# EAGLE design ForceBoard (EAGLE 9.4.2)
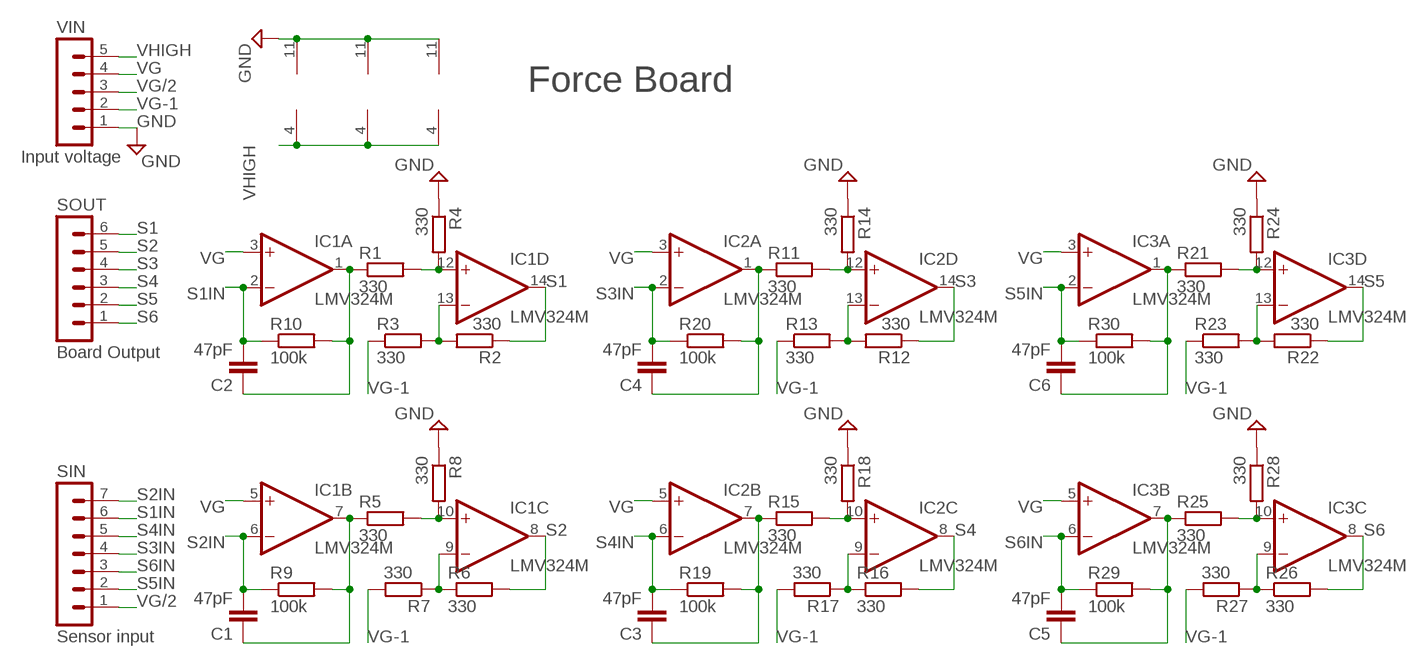
[diagram p0: schematic, sheet 1]

## Parts
C1  47pF  C-EUC0805  [C0805]
C2  47pF  C-EUC0805  [C0805]
C3  47pF  C-EUC0805  [C0805]
C4  47pF  C-EUC0805  [C0805]
C5  47pF  C-EUC0805  [C0805]
C6  47pF  C-EUC0805  [C0805]
IC1  LMV324M  [SO14]
IC2  LMV324M  [SO14]
IC3  LMV324M  [SO14]
R1  330  R-EU_R0805  [R0805]
R2  330  R-EU_R0805  [R0805]
R3  330  R-EU_R0805  [R0805]
R4  330  R-EU_R0805  [R0805]
R5  330  R-EU_R0805  [R0805]
R6  330  R-EU_R0805  [R0805]
R7  330  R-EU_R0805  [R0805]
R8  330  R-EU_R0805  [R0805]
R9  100k  R-EU_R0805  [R0805]
R10  100k  R-EU_R0805  [R0805]
R11  330  R-EU_R0805  [R0805]
R12  330  R-EU_R0805  [R0805]
R13  330  R-EU_R0805  [R0805]
R14  330  R-EU_R0805  [R0805]
R15  330  R-EU_R0805  [R0805]
R16  330  R-EU_R0805  [R0805]
R17  330  R-EU_R0805  [R0805]
R18  330  R-EU_R0805  [R0805]
R19  100k  R-EU_R0805  [R0805]
R20  100k  R-EU_R0805  [R0805]
R21  330  R-EU_R0805  [R0805]
R22  330  R-EU_R0805  [R0805]
R23  330  R-EU_R0805  [R0805]
R24  330  R-EU_R0805  [R0805]
R25  330  R-EU_R0805  [R0805]
R26  330  R-EU_R0805  [R0805]
R27  330  R-EU_R0805  [R0805]
R28  330  R-EU_R0805  [R0805]
R29  100k  R-EU_R0805  [R0805]
R30  100k  R-EU_R0805  [R0805]
SIN  Sensor input  MA07-1  [MA07-1]
SOUT  Board Output  MA06-1  [MA06-1]
VIN  Input voltage  MA05-1  [MA05-1]

## Nets
GND: IC1.11(P:V-) IC2.11(P:V-) IC3.11(P:V-) R4.1 R8.1 R14.1 R18.1 R24.1 R28.1 VIN.1
N$1: IC2.13(D:-IN) R12.2 R13.2
N$2: IC1.10(C:+IN) R5.2 R8.2
N$3: IC1.13(D:-IN) R2.2 R3.2
N$4: C1.1 IC1.7(B:OUT) R5.1 R9.2
N$5: IC1.9(C:-IN) R6.1 R7.1
N$6: IC1.12(D:+IN) R1.2 R4.2
N$7: C3.1 IC2.7(B:OUT) R15.1 R19.2
N$8: IC2.9(C:-IN) R16.1 R17.1
N$9: C2.1 IC1.1(A:OUT) R1.1 R10.2
N$10: IC2.10(C:+IN) R15.2 R18.2
N$11: IC2.12(D:+IN) R11.2 R14.2
N$12: C4.1 IC2.1(A:OUT) R11.1 R20.2
N$13: IC3.13(D:-IN) R22.2 R23.2
N$14: C5.1 IC3.7(B:OUT) R25.1 R29.2
N$15: IC3.9(C:-IN) R26.1 R27.1
N$16: IC3.10(C:+IN) R25.2 R28.2
N$17: IC3.12(D:+IN) R21.2 R24.2
N$18: C6.1 IC3.1(A:OUT) R21.1 R30.2
S1: IC1.14(D:OUT) R2.1 SOUT.6
S1IN: C2.2 IC1.2(A:-IN) R10.1 SIN.6
S2: IC1.8(C:OUT) R6.2 SOUT.5
S2IN: C1.2 IC1.6(B:-IN) R9.1 SIN.7
S3: IC2.14(D:OUT) R12.1 SOUT.4
S3IN: C4.2 IC2.2(A:-IN) R20.1 SIN.4
S4: IC2.8(C:OUT) R16.2 SOUT.3
S4IN: C3.2 IC2.6(B:-IN) R19.1 SIN.5
S5: IC3.14(D:OUT) R22.1 SOUT.2
S5IN: C6.2 IC3.2(A:-IN) R30.1 SIN.2
S6: IC3.8(C:OUT) R26.2 SOUT.1
S6IN: C5.2 IC3.6(B:-IN) R29.1 SIN.3
VG: IC1.3(A:+IN) IC1.5(B:+IN) IC2.3(A:+IN) IC2.5(B:+IN) IC3.3(A:+IN) IC3.5(B:+IN) VIN.4
VG-1: R3.1 R7.2 R13.1 R17.2 R23.1 R27.2 VIN.2
VG/2: SIN.1 VIN.3
VHIGH: IC1.4(P:V+) IC2.4(P:V+) IC3.4(P:V+) VIN.5

## Notes on the sheet
- Force Board

## Library data of the parts
C1-C6 = rcl:C-EU: CAPACITOR, European symbol; SPICEPREFIX: C
IC1-IC3 = linear:LMV324?*: Quad General Purpose, Low Voltage, Rail-to-Rail Output Operational Amplifiers Source: http://www.national.com/mpf/LM/LMV321.html http://www.national.com/dt/lmv_qual.pdf
R1-R30 = rcl:R-EU_: RESISTOR, European symbol; SPICEPREFIX: R
SIN = con-lstb:MA07-1: PIN HEADER; OC_FARNELL: unknown; OC_NEWARK: unknown
SOUT = con-lstb:MA06-1: PIN HEADER; OC_FARNELL: unknown; OC_NEWARK: unknown
VIN = con-lstb:MA05-1: PIN HEADER; OC_FARNELL: unknown; OC_NEWARK: unknown

## Board
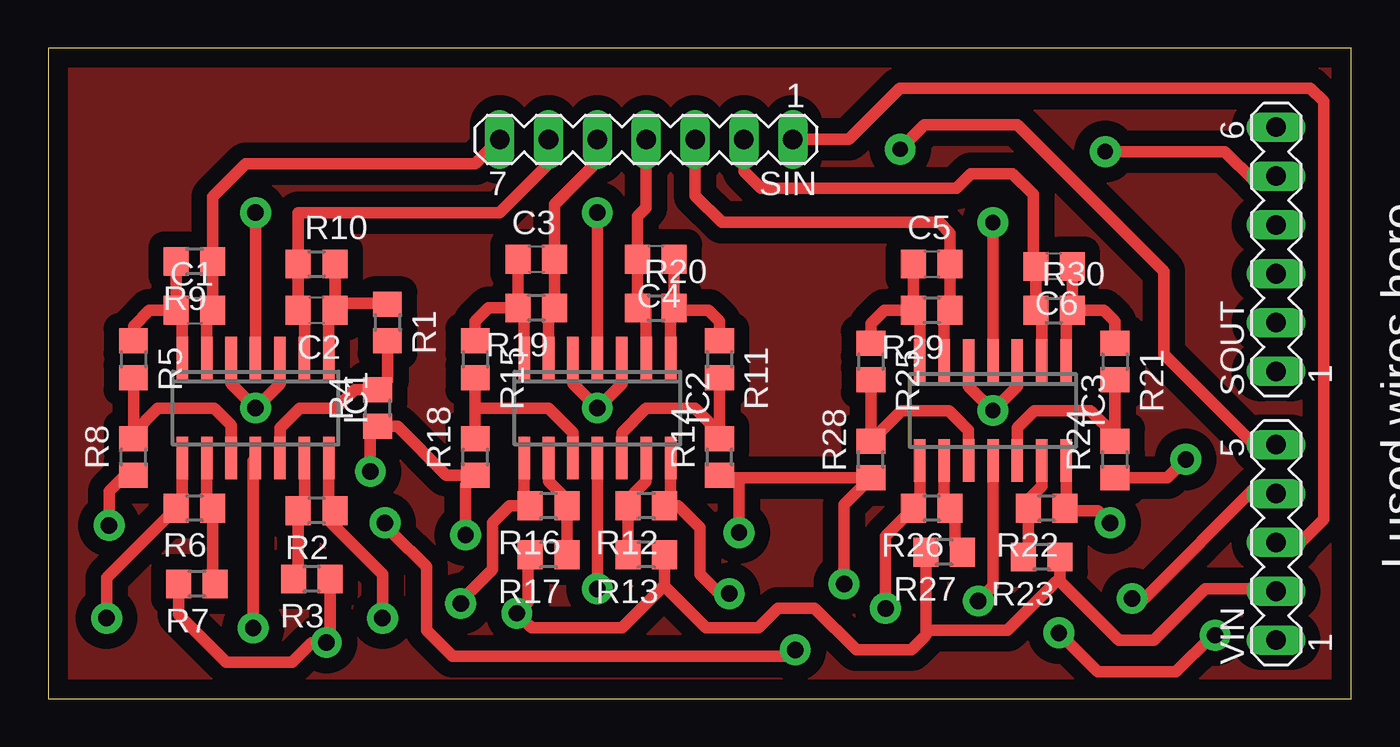
[diagram p1: board, top side]
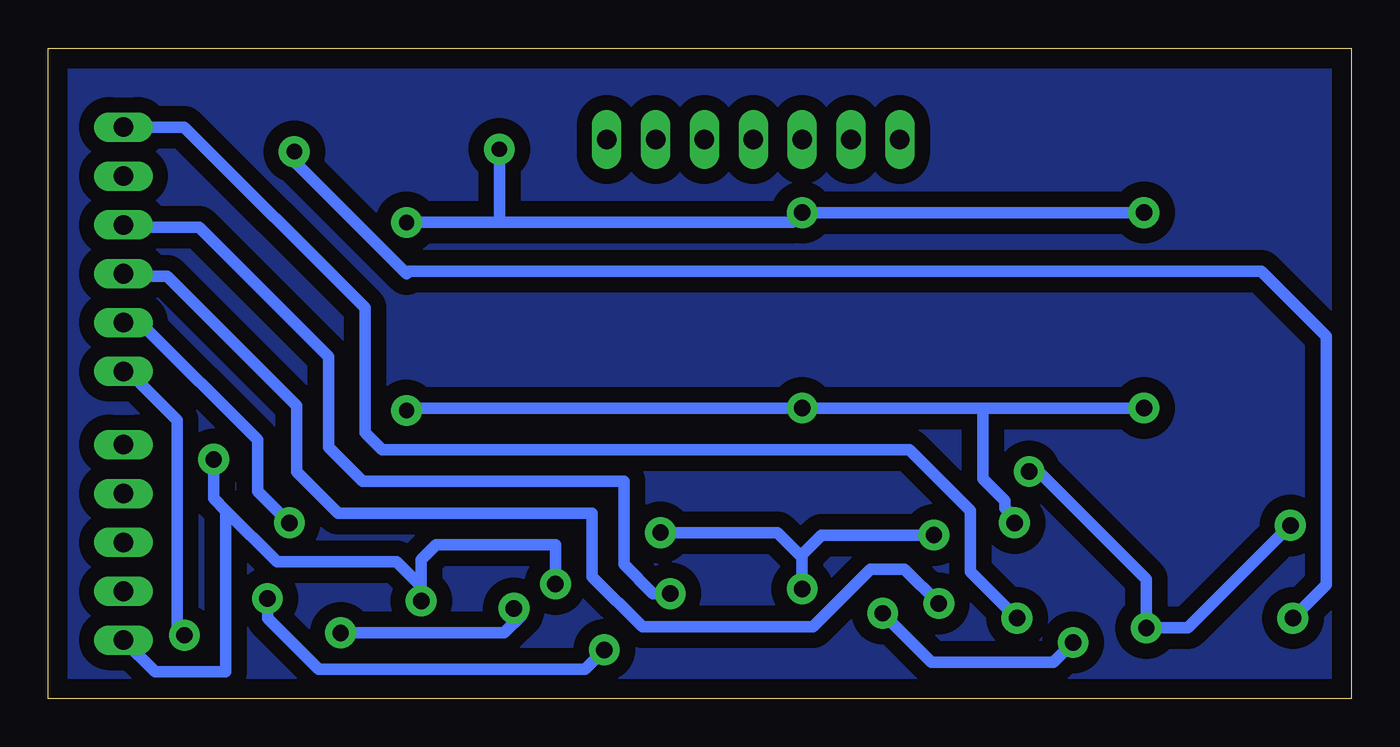
[diagram p2: board, bottom side, seen from below]

Size 67.8 x 33.83 mm. Coordinates in mm from the lower left corner, seen from the top.
Outline: 0,0 67.8,0 67.8,33.83 0,33.83 0,0
Copper layers (1*16): Top 0.035mm / dielectric 1.5mm / Bottom 0.035mm
Design rules "default": minimum track width 6mil, minimum drill 0.35mm, track to track 6mil, track to pad 6mil, pad to pad 6mil, via to via 6mil, smd to smd 6mil, copper to edge 40mil, drill to drill 6mil, minimum pad ring 10mil, minimum via ring 8mil, stop-mask expansion 4mil, vias tented up to drill 0mil, thermal gap 10mil

### Footprints (pad centres in the part's own frame; a part is rotated, then mirrored left to right if it is on the bottom)
C0805 = smd 1.3 x 1.5: 1 -0.95,0; 2 0.95,0
SO14 = smd 0.6 x 2.2: 1 -3.81,-2.6; 2 -2.54,-2.6; 3 -1.27,-2.6; 4 0,-2.6; 5 1.27,-2.6; 6 2.54,-2.6; 7 3.81,-2.6; 8 3.81,2.6; 9 2.54,2.6; 10 1.27,2.6; 11 0,2.6; 12 -1.27,2.6; 13 -2.54,2.6; 14 -3.81,2.6
R0805 = smd 1.3 x 1.5: 1 -0.95,0; 2 0.95,0
MA07-1 = drill 1.016 long: 1 -7.62,0; 2 -5.08,0; 3 -2.54,0; 4 0,0; 5 2.54,0; 6 5.08,0; 7 7.62,0
MA06-1 = drill 1.016 long: 1 -6.35,0; 2 -3.81,0; 3 -1.27,0; 4 1.27,0; 5 3.81,0; 6 6.35,0
MA05-1 = drill 1.016 long: 1 -5.08,0; 2 -2.54,0; 3 0,0; 4 2.54,0; 5 5.08,0

### Placement (x,y rotation side)
C1  7.62,20.19 0 top
C2  13.97,20.19 180 top
C3  25.4,22.86 0 top
C4  31.62,22.86 180 top
C5  45.97,22.61 0 top
C6  52.32,22.48 180 top
IC1  10.8,15.11 180 top
IC2  28.57,15.11 180 top
IC3  49.15,14.99 180 top
R1  17.65,19.56 270 top
R2  13.97,9.78 180 top
R3  13.72,6.22 180 top
R4  17.14,15.11 90 top
R5  4.45,17.65 270 top
R6  7.62,9.91 180 top
R7  7.75,5.97 180 top
R8  4.45,12.57 90 top
R9  7.62,22.73 180 top
R10  13.97,22.61 0 top
R11  34.92,17.65 270 top
R12  31.11,10.03 180 top
R13  31.11,7.49 180 top
R14  34.92,12.57 90 top
R15  22.23,17.65 270 top
R16  26.04,10.03 180 top
R17  26.04,7.49 180 top
R18  22.23,12.57 90 top
R19  25.4,20.32 180 top
R20  31.62,20.32 0 top
R21  55.5,17.53 270 top
R22  51.94,9.91 180 top
R23  51.69,7.37 180 top
R24  55.5,12.45 90 top
R25  42.8,17.53 270 top
R26  45.97,9.91 180 top
R27  46.61,7.62 180 top
R28  42.8,12.45 90 top
R29  45.97,20.19 180 top
R30  52.32,20.19 0 top
SIN  31.11,29.08 180 top
SOUT  63.88,23.37 90 top
VIN  63.88,8.13 90 top

### Tracks (layer width: path | path; a pad name or v marks a point on that pad's centre or on a via)
BOT
  pour Bottom (isolate 0.8): 67.44,0.13 67.44,33.15 0.38,33.15 0.38,0.13
GND  (via drill 0.85 pad 1.6)
  Top 0.61: IC1.11 10.67,12.39 v10.67,3.68 | v16.76,11.81 16.76,13.78 R4.1 18.17,14.16 20.71,11.62 R18.1 21.72,11.12 v21.72,8.51 | R8.1 4,11.62 3.18,10.79 v3.18,9.02 | IC2.11 v28.57,5.71 | R14.1 35.05,11.5 35.94,11.5 | 35.94,11.5 v35.94,8.64 | v41.4,5.97 41.4,10.1 R28.1 35.94,11.5 | IC3.11 49.15,5.84 v48.39,5.08 | v59.18,12.45 58.23,11.5 R24.1
  Bottom 0.61: v16.76,11.81 16.64,11.68 16.13,11.68 10.67,6.22 v10.67,3.68 8.51,3.68 v3.18,9.02 | v35.94,8.64 29.85,8.64 28.57,7.37 v28.57,5.71 28.57,7.49 27.56,8.51 v21.72,8.51 | v41.4,5.97 41.4,8 47.62,8 48.39,7.24 v48.39,5.08 48.39,5.84 49.66,7.11 55.88,7.11 58.55,9.78 | VIN.1 62.23,1.4 58.55,1.4 58.55,9.78 | v59.18,12.45 59.18,10.41 58.55,9.78
N$1
  Top 0.61: R13.2 R12.2 29.85,10.03 31.11,11.3 IC2.13
N$2
  Top 0.61: R5.2 R8.2 4.45,13.84 5.71,15.11 8.64,15.11 9.53,14.22 IC1.10
N$3
  Top 0.61: R3.2 13.02,6.48 R2.2 13.34,10.09 IC1.13
N$4
  Top 0.61: C1.1 6.98,19.88 IC1.7 | R9.2 C1.1 | R5.1 4.45,19.36 5.27,20.19 C1.1
N$5
  Top 0.61: IC1.9 8.26,10.22 R6.1 8.57,6.1 R7.1
N$6
  Top 0.61: R1.2 17.65,16.57 R4.2 15.94,16.06 14.99,15.11 13.08,15.11 12.07,14.1 IC1.12
N$7
  Top 0.61: IC2.7 24.77,20 R19.2 | C3.1 R19.2 | R15.1 22.23,19.62 22.93,20.32 R19.2
N$8
  Top 0.61: IC2.9 26.04,11.3 26.99,10.35 R16.1 R17.1
N$9
  Top 0.61: R1.1 17.59,20.57 14.61,20.57 14.61,20.19 | 14.61,20.19 C2.1 R10.2 | IC1.1 14.61,20.19
N$10
  Top 0.61: R15.2 22.23,15.11 | 22.23,15.11 R18.2 | 22.23,15.11 26.04,15.11 27.31,13.84 IC2.10
N$11
  Top 0.61: R11.2 34.92,13.84 | 34.92,13.84 R14.2 | IC2.12 29.85,13.84 31.11,15.11 33.66,15.11 34.92,13.84
N$12
  Top 0.61: R11.1 34.92,19.62 34.35,20.19 32.39,20.19 | IC2.1 32.39,20.19 | 32.39,20.19 32.39,20.32 R20.2 C4.1
N$13
  Top 0.61: IC3.13 51.69,11.05 50.99,10.35 R22.2 50.99,7.62 R23.2
N$14
  Top 0.61: C5.1 R29.2 | IC3.7 45.34,19.88 R29.2 | R29.2 43.5,20.19 42.8,19.49 R25.1
N$15
  Top 0.61: R27.1 47.18,8 47.18,9.65 R26.1 46.61,9.91 IC3.9
N$16
  Top 0.61: R25.2 R28.2 44.39,14.99 46.86,14.99 47.88,13.97 IC3.10
N$17
  Top 0.61: IC3.12 50.42,14.1 51.31,14.99 54.23,14.99 55.5,13.72 R24.2 R21.2
N$18
  Top 0.61: C6.1 R30.2 | R21.1 55.5,19.62 54.92,20.19 R30.2 | R30.2 52.96,19.88 IC3.1
S1  (via drill 0.85 pad 1.6)
  Top 0.61: R2.1 14.61,9.46 | v17.4,4.19 17.4,6.48 14.61,9.27 14.61,9.46 | IC1.14 14.61,9.53 14.61,9.46
  Bottom 0.61: v17.4,4.19 19.81,6.6 19.81,9.78 22.99,12.95 50.42,12.95 51.31,13.84 51.31,20.32 60.71,29.72 SOUT.6
S1IN
  Top 0.61: SIN.6 26.04,27.81 23.5,25.27 13.02,25.27 R10.1 C2.2 13.02,20 13.34,19.68 IC1.2
S2  (via drill 0.8 pad 1.6, 0.85 pad 1.6)
  Top 0.61: v54.99,28.45 61.21,28.45 62.74,26.92 63.63,26.92 SOUT.5 | v3.05,4.19 3.05,6.28 R6.2 6.98,10.22 IC1.8
  Bottom 0.61: v54.99,28.45 54.99,27.94 49.15,22.1 49.02,22.22 4.7,22.22 1.32,18.85 1.32,5.92 v3.05,4.19
S2IN
  Top 0.61: SIN.7 22.23,27.81 10.29,27.81 8.57,26.1 R9.1 C1.2 8.26,20.19 IC1.6
S3  (via drill 0.85 pad 1.6)
  Top 0.61: IC2.14 32.39,10.35 R12.1 32.77,10.03 33.91,8.89 33.91,6.48 34.92,5.46 v35.43,5.46
  Bottom 0.61: v35.43,5.46 36.32,5.46 37.85,6.99 37.85,11.3 51.44,11.3 53.21,13.08 53.21,17.78 59.94,24.51 63.75,24.51 SOUT.4
S3IN
  Top 0.61: SIN.4 31.11,25.53 30.67,25.08 C4.2 R20.1 30.74,20.25 31.05,20.25 31.11,20.19 IC2.2
S4  (via drill 0.85 pad 1.6)
  Top 0.61: IC2.8 24.77,10.35 R16.2 24,10.03 23.11,9.14 23.11,6.73 21.46,5.08 v21.46,4.95
  Bottom 0.61: v21.46,4.95 23.24,6.73 25.02,6.73 28.02,3.73 36.88,3.73 39.5,6.35 39.5,9.65 52.7,9.65 54.86,11.81 54.86,15.24 61.59,21.97 63.75,21.97 SOUT.3
S4IN
  Top 0.61: IC2.6 26.04,20.32 R19.1 C3.2 26.35,25.71 28.57,27.94 SIN.5
S5  (via drill 0.85 pad 1.6)
  Top 0.61: R22.1 52.93,9.94 | v55.25,9.14 54.61,9.78 53.09,9.78 52.93,9.94 | 52.93,9.94 52.8,10.07 52.96,10.23 IC3.14
  Bottom 0.61: SOUT.2 63.75,19.43 62.86,19.43 56.9,13.46 56.9,10.79 v55.25,9.14
S5IN
  Top 0.61: SIN.2 36.19,27.43 37.08,26.54 47.24,26.54 48.01,27.3 50.17,27.3 51.25,26.22 51.25,22.61 C6.2 R30.1 51.69,20.19 IC3.2
S6  (via drill 0.85 pad 1.6)
  Top 0.61: R26.2 | v43.56,4.7 43.56,8.45 R26.2 | R26.2 45.34,10.23 IC3.8 | v60.71,3.3 60.58,3.3 58.67,1.4 54.61,1.4 v52.58,3.43
  Bottom 0.61: SOUT.1 63.63,17.02 61.09,14.48 61.09,3.68 v60.71,3.3 | v52.58,3.43 44.07,3.43 43.18,4.32 43.18,4.7 v43.56,4.7
S6IN
  Top 0.61: SIN.3 33.66,26.16 35.05,24.77 46.36,24.77 46.92,24.2 C5.2 R29.1 46.61,19.88 IC3.6
TOP
  pour Top (isolate 0.8): 0.38,33.15 0.38,0.13 67.44,0.13 67.44,33.66 0.38,33.66
VG  (via drill 0.8 pad 1.6, 0.85 pad 1.6)
  Top 0.61: IC1.5 9.53,16.38 v10.8,15.11 12.07,16.38 IC1.3 | IC2.5 27.31,16.38 v28.57,15.11 29.85,16.38 IC2.3 | IC3.5 47.88,16.26 v49.15,14.99 50.42,16.26 IC3.3 | v17.53,9.14 17.91,8.76 17.91,8.64 19.68,6.86 19.68,3.56 21.03,2.21 38.53,2.21 v38.86,2.54 | v56.39,5.21 57.02,5.21 62.88,11.06 63.49,11.06 VIN.4
  Bottom 0.61: 19.18,15.11 v28.57,15.11 49.02,15.11 v49.15,14.99 | v10.8,15.11 19.18,15.11 | 19.18,15.11 19.18,11.43 18.03,10.29 18.03,9.91 17.53,9.4 v17.53,9.14 | v56.39,5.21 56.39,4.19 53.72,1.52 39.88,1.52 v38.86,2.54
VG-1  (via drill 0.85 pad 1.6)
  Top 0.61: R3.1 14.67,3.11 v14.48,2.92 13.72,2.92 12.7,1.9 9.27,1.9 6.8,4.38 R7.2 | R17.2 24.96,7.37 24.96,5.02 v24.38,4.45 25.15,3.68 29.85,3.68 32.06,5.9 R13.1 32.06,5.84 34.22,3.68 36.96,3.68 37.97,4.7 39.88,4.7 42.04,2.54 44.9,2.54 45.66,3.3 45.66,3.62 | 45.66,3.62 45.72,3.56 49.91,3.56 52.45,6.1 52.64,6.1 | R23.1 52.64,6.1 | 52.64,6.1 55.69,3.05 57.53,3.05 60.2,5.71 63.75,5.71 VIN.2 | 45.66,3.62 R27.2
  Bottom 0.61: v24.38,4.45 21.84,1.9 15.49,1.9 v14.48,2.92
VG/2
  Top 0.61: VIN.3 65.15,8.13 66.35,9.33 66.35,31.06 65.66,31.75 44.32,31.75 41.66,29.08 SIN.1
VHIGH  (via drill 0.8 pad 1.6, 0.85 pad 1.6)
  Top 0.61: IC1.4 v10.8,25.27 | IC2.4 v28.57,25.27 | IC3.4 v49.15,24.77 | v44.32,28.57 45.59,29.84 50.42,29.84 58.04,22.22 58.04,17.91 62.74,13.21 VIN.5
  Bottom 0.61: v10.8,25.27 v28.57,25.27 29.08,24.77 v49.15,24.77 44.32,24.77 v44.32,28.57

### Text on the board
tNames: I used wires here
bValues: Force Board